# Altium schematic sheet F407.SchDoc
size A2
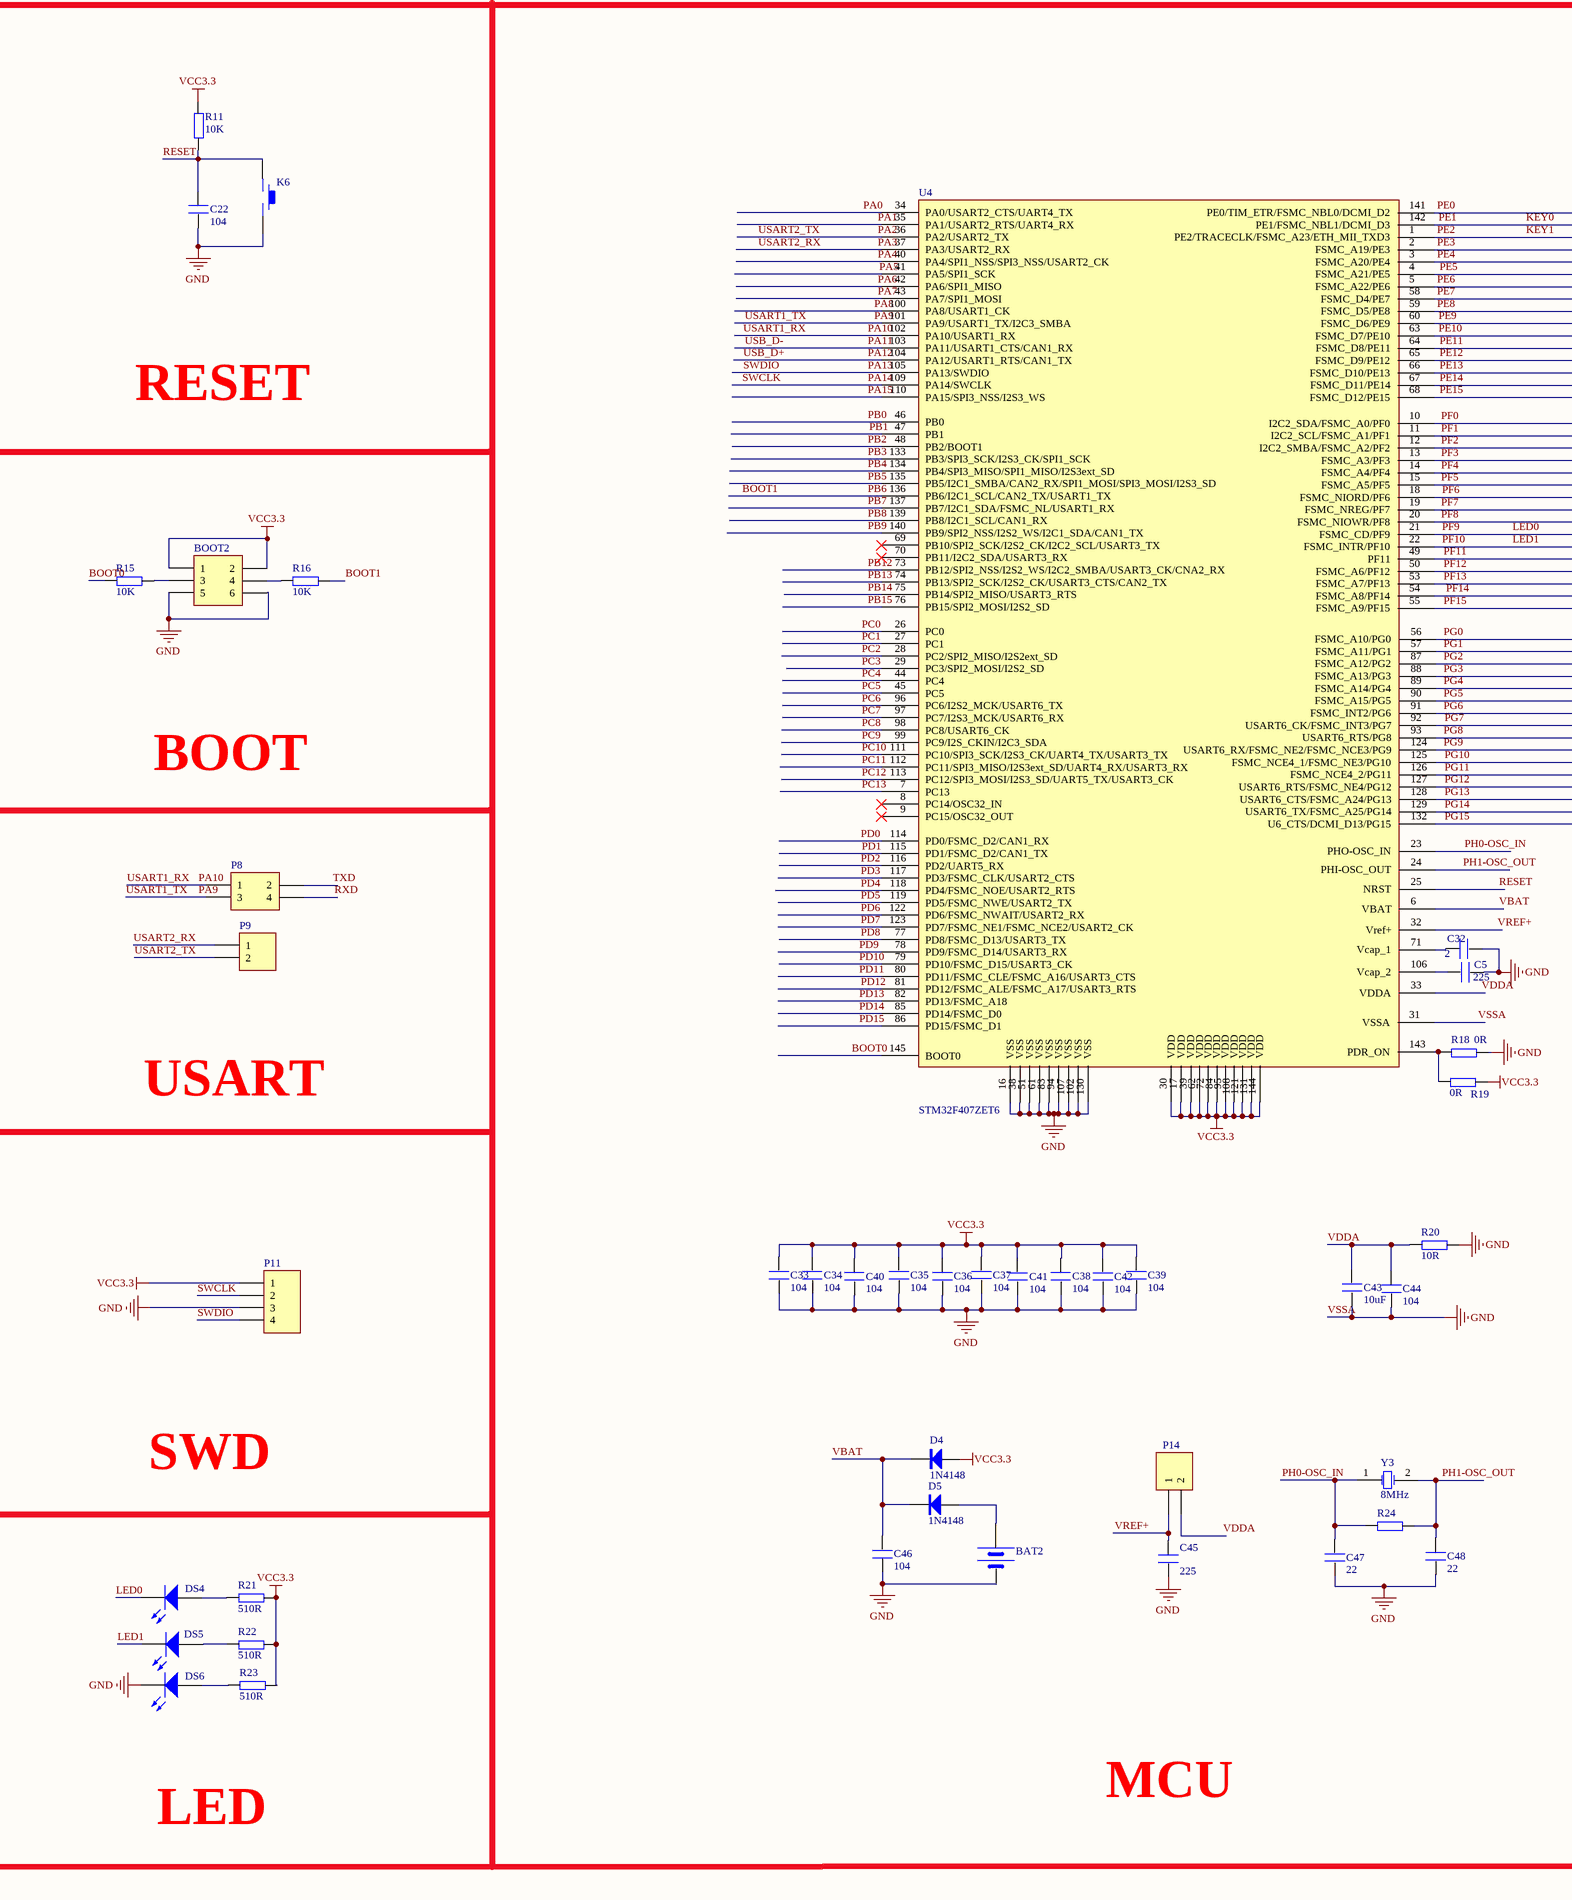
[diagram p0: F407.SchDoc, left]
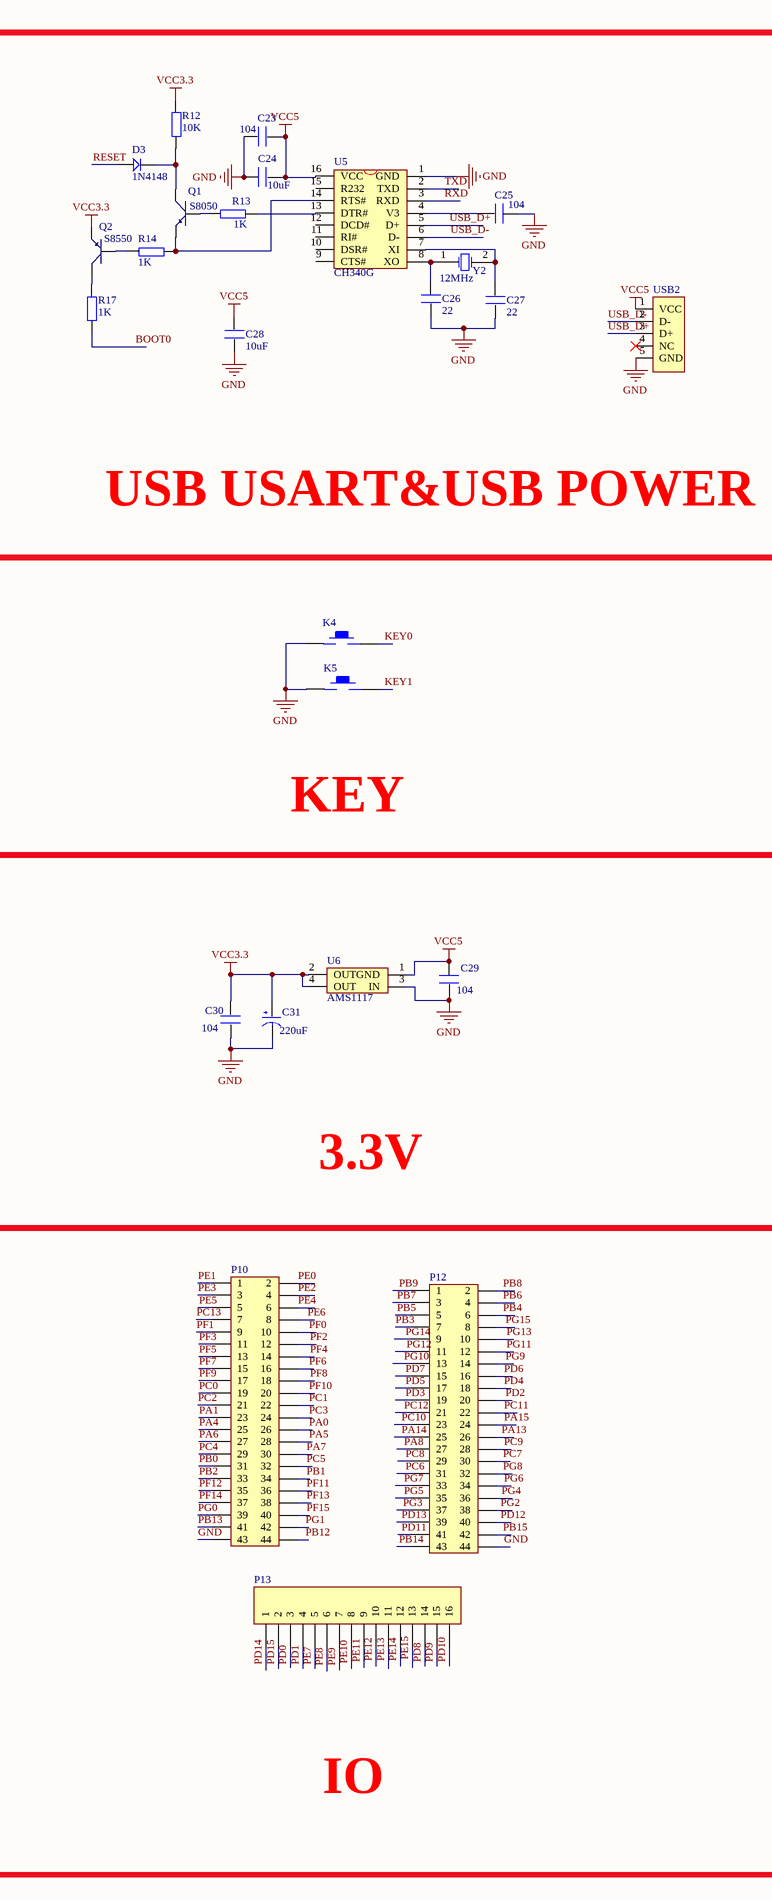
[diagram p1: F407.SchDoc, right]

## Parts
2  225  [0603P]
BAT2  BAT  [BATM]  (value not drawn)
BOOT2  Header 3X2  [HDR2X3]  (value not drawn)
C22  104  [0603P]
C23  104  [0603P]
C24  10uF  [0603P]
C25  104  [0603P]
C26  22  [0603P]
C27  22  [0603P]
C28  10uF  [0603P]
C29  104  [0603P]
C30  104  [0603P]
C31  220uF  [C1206]
C32  C5  [0603P]
C33  104  [0603P]
C34  104  [0603P]
C35  104  [0603P]
C36  104  [0603P]
C37  104  [0603P]
C38  104  [0603P]
C39  104  [0603P]
C40  104  [0603P]
C41  104  [0603P]
C42  104  [0603P]
C43  10uF  [0603P]
C44  104  [0603P]
C45  225  [0603P]
C46  104  [0603P]
C47  22  [0603P]
C48  22  [0603P]
D3  1N4148  [SOD-123]
D4  1N4148  [MINI_MELF (LL34)]
D5  1N4148  [MINI_MELF (LL34)]
DS4  LED0  [SMDLED]  (value not drawn)
DS5  LED1  [SMDLED]  (value not drawn)
DS6  LED3  [SMDLED]  (value not drawn)
K4  KEY_M  [KEY_M]  (value not drawn)
K5  KEY_M  [KEY_M]  (value not drawn)
K6  (no value)  [KEY_M]
P8  Header 2X2  [HDR2X2]  (value not drawn)
P9  Header 2  [HDR1X2]  (value not drawn)
P10  HEAD2*22  [HEAD2*22]  (value not drawn)
P11  Header 4  [HDR1X4]  (value not drawn)
P12  HEAD2*22  [HEAD2*22]  (value not drawn)
P13  Header 16  [HDR1X16]  (value not drawn)
P14  (no value)  [HDR1X2]
Q1  S8050  [SOT-23R]
Q2  S8550  [SOT-23R]
R11  10K  [0805]
R12  10K  [0805]
R13  1K  [0805]
R14  1K  [0805]
R15  10K  [0805]
R16  10K  [0805]
R17  1K  [0805]
R18  0R  [0805]
R19  0R  [0805]
R20  10R  [0805]
R21  510R  [0805]
R22  510R  [0805]
R23  510R  [0805]
R24  R  [0805]  (value not drawn)
U4  STM32F407ZET6  [LQFP144]
U5  CH340G  [SOP16M]
U6  AMS1117  [AMS1117]
USB2  USB5  [USB/SM0.8-6H5]  (value not drawn)
Y2  12MHz  [XTAL_US]
Y3  8MHz  [XTAL_US]

## Nets
GND: 2.2 BAT2.2(GND) BOOT2.5 BOOT2.6 C22.1 C23.1 C24.1 C25.1 C26.1 C27.1 C28.1 C29.1 C30.1 C31.2(GND) C32.2 C33.1 C34.1 C35.1 C36.1 C37.1 C38.1 C39.1 C40.1 C41.1 C42.1 C43.1 C44.1 C45.1 C46.2 C47.1 C48.1 DS6.2(K) K4.1 K5.1 K6.2 P10.43 P11.3 P12.44 R18.2 R20.2 U4.16(VSS) U4.31(VSSA) U4.38(VSS) U4.51(VSS) U4.61(VSS) U4.83(VSS) U4.94(VSS) U4.102(VSS) U4.107(VSS) U4.130(VSS) U5.1(GND) U6.3(IN) USB2.5(GND)  [also labelled VSSA]
VCC3.3: BOOT2.1 BOOT2.2 C30.2 C31.1(VCC) C33.2 C34.2 C35.2 C36.2 C37.2 C38.2 C39.2 C40.2 C41.2 C42.2 D4.1(A) P11.1 Q2.1(E) R11.2 R12.2 R19.2 R21.2 R22.2 R23.2 U4.17(VDD) U4.30(VDD) U4.39(VDD) U4.62(VDD) U4.72(VDD) U4.84(VDD) U4.95(VDD) U4.108(VDD) U4.121(VDD) U4.131(VDD) U4.144(VDD) U6.2(OUT) U6.4(OUT)
VCC5: C23.2 C24.2 C28.2 C29.2 U5.16(VCC) U6.1(GND) USB2.1(VCC)
BOOT0: R15.1 R17.1 U4.145(BOOT0)
BOOT1: P12.4 R16.2 U4.136(PB6/I2C1_SCL/CAN2_TX/USART1_TX)  [also labelled PB6]
KEY0: K4.2 P10.1 U4.142(PE1/FSMC_NBL1/DCMI_D3)  [also labelled PE1]
KEY1: K5.2 P10.4 U4.1(PE2/TRACECLK/FSMC_A23/ETH_MII_TXD3)  [also labelled PE2]
LED0: DS4.2(K) P10.17 U4.21(FSMC_CD/PF9)  [also labelled PF9]
LED1: DS5.2(K) P10.20 U4.22(FSMC_INTR/PF10)  [also labelled PF10]
PA0: P10.26 U4.34(PA0/USART2_CTS/UART4_TX)
PA1: P10.23 U4.35(PA1/USART2_RTS/UART4_RX)
PA2: P9.2 U4.36(PA2/USART2_TX)  [also labelled USART2_TX]
PA3: P9.1 U4.37(PA3/USART2_RX)  [also labelled USART2_RX]
PA4: P10.25 U4.40(PA4/SPI1_NSS/SPI3_NSS/USART2_CK)
PA5: P10.28 U4.41(PA5/SPI1_SCK)
PA6: P10.27 U4.42(PA6/SPI1_MISO)
PA7: P10.30 U4.43(PA7/SPI1_MOSI)
PA8: P12.27 U4.100(PA8/USART1_CK)
PA9: P8.3 U4.101(PA9/USART1_TX/I2C3_SMBA)  [also labelled USART1_TX]
PA10: P8.1 U4.102(PA10/USART1_RX)  [also labelled USART1_RX]
PA11: U4.103(PA11/USART1_CTS/CAN1_RX) U5.6(D-) USB2.2(D-)  [also labelled USB_D-]
PA12: U4.104(PA12/USART1_RTS/CAN1_TX) U5.5(D+) USB2.3(D+)  [also labelled USB_D+]
PA13: P11.4 P12.26 U4.105(PA13/SWDIO)  [also labelled SWDIO]
PA14: P11.2 P12.25 U4.109(PA14/SWCLK)  [also labelled SWCLK]
PA15: P12.24 U4.110(PA15/SPI3_NSS/I2S3_WS)
PB0: P10.31 U4.46(PB0)
PB1: P10.34 U4.47(PB1)
PB2: P10.33 U4.48(PB2/BOOT1)
PB3: P12.7 U4.133(PB3/SPI3_SCK/I2S3_CK/SPI1_SCK)
PB4: P12.6 U4.134(PB4/SPI3_MISO/SPI1_MISO/I2S3ext_SD)
PB5: P12.5 U4.135(PB5/I2C1_SMBA/CAN2_RX/SPI1_MOSI/SPI3_MOSI/I2S3_SD)
PB7: P12.3 U4.137(PB7/I2C1_SDA/FSMC_NL/USART1_RX)
PB8: P12.2 U4.139(PB8/I2C1_SCL/CAN1_RX)
PB9: P12.1 U4.140(PB9/SPI2_NSS/I2S2_WS/I2C1_SDA/CAN1_TX)
PB12: P10.44 U4.73(PB12/SPI2_NSS/I2S2_WS/I2C2_SMBA/USART3_CK/CNA2_RX)
PB13: P10.41 U4.74(PB13/SPI2_SCK/I2S2_CK/USART3_CTS/CAN2_TX)
PB14: P12.43 U4.75(PB14/SPI2_MISO/USART3_RTS)
PB15: P12.42 U4.76(PB15/SPI2_MOSI/I2S2_SD)
PC0: P10.19 U4.26(PC0)
PC1: P10.22 U4.27(PC1)
PC2: P10.21 U4.28(PC2/SPI2_MISO/I2S2ext_SD)
PC3: P10.24 U4.29(PC3/SPI2_MOSI/I2S2_SD)
PC4: P10.29 U4.44(PC4)
PC5: P10.32 U4.45(PC5)
PC6: P12.31 U4.96(PC6/I2S2_MCK/USART6_TX)
PC7: P12.30 U4.97(PC7/I2S3_MCK/USART6_RX)
PC8: P12.29 U4.98(PC8/USART6_CK)
PC9: P12.28 U4.99(PC9/I2S_CKIN/I2C3_SDA)
PC10: P12.23 U4.111(PC10/SPI3_SCK/I2S3_CK/UART4_TX/USART3_TX)
PC11: P12.22 U4.112(PC11/SPI3_MISO/I2S3ext_SD/UART4_RX/USART3_RX)
PC12: P12.21 U4.113(PC12/SPI3_MOSI/I2S3_SD/UART5_TX/USART3_CK)
PC13: P10.7 U4.7(PC13)
PD0: P13.3 U4.114(PD0/FSMC_D2/CAN1_RX)
PD1: P13.4 U4.115(PD1/FSMC_D2/CAN1_TX)
PD2: P12.20 U4.116(PD2/UART5_RX)
PD3: P12.19 U4.117(PD3/FSMC_CLK/USART2_CTS)
PD4: P12.18 U4.118(PD4/FSMC_NOE/USART2_RTS)
PD5: P12.17 U4.119(PD5/FSMC_NWE/USART2_TX)
PD6: P12.16 U4.122(PD6/FSMC_NWAIT/USART2_RX)
PD7: P12.15 U4.123(PD7/FSMC_NE1/FSMC_NCE2/USART2_CK)
PD8: P13.14 U4.77(PD8/FSMC_D13/USART3_TX)
PD9: P13.15 U4.78(PD9/FSMC_D14/USART3_RX)
PD10: P13.16 U4.79(PD10/FSMC_D15/USART3_CK)
PD11: P12.41 U4.80(PD11/FSMC_CLE/FSMC_A16/USART3_CTS)
PD12: P12.40 U4.81(PD12/FSMC_ALE/FSMC_A17/USART3_RTS)
PD13: P12.39 U4.82(PD13/FSMC_A18)
PD14: P13.1 U4.85(PD14/FSMC_D0)
PD15: P13.2 U4.86(PD15/FSMC_D1)
PE0: P10.2 U4.141(PE0/TIM_ETR/FSMC_NBL0/DCMI_D2)
PE3: P10.3 U4.2(FSMC_A19/PE3)
PE4: P10.6 U4.3(FSMC_A20/PE4)
PE5: P10.5 U4.4(FSMC_A21/PE5)
PE6: P10.8 U4.5(FSMC_A22/PE6)
PE7: P13.5 U4.58(FSMC_D4/PE7)
PE8: P13.6 U4.59(FSMC_D5/PE8)
PE9: P13.7 U4.60(FSMC_D6/PE9)
PE10: P13.8 U4.63(FSMC_D7/PE10)
PE11: P13.9 U4.64(FSMC_D8/PE11)
PE12: P13.10 U4.65(FSMC_D9/PE12)
PE13: P13.11 U4.66(FSMC_D10/PE13)
PE14: P13.12 U4.67(FSMC_D11/PE14)
PE15: P13.13 U4.68(FSMC_D12/PE15)
PF0: P10.10 U4.10(I2C2_SDA/FSMC_A0/PF0)
PF1: P10.9 U4.11(I2C2_SCL/FSMC_A1/PF1)
PF2: P10.12 U4.12(I2C2_SMBA/FSMC_A2/PF2)
PF3: P10.11 U4.13(FSMC_A3/PF3)
PF4: P10.14 U4.14(FSMC_A4/PF4)
PF5: P10.13 U4.15(FSMC_A5/PF5)
PF6: P10.16 U4.18(FSMC_NIORD/PF6)
PF7: P10.15 U4.19(FSMC_NREG/PF7)
PF8: P10.18 U4.20(FSMC_NIOWR/PF8)
PF11: P10.36 U4.49(PF11)
PF12: P10.35 U4.50(FSMC_A6/PF12)
PF13: P10.38 U4.53(FSMC_A7/PF13)
PF14: P10.37 U4.54(FSMC_A8/PF14)
PF15: P10.40 U4.55(FSMC_A9/PF15)
PG0: P10.39 U4.56(FSMC_A10/PG0)
PG1: P10.42 U4.57(FSMC_A11/PG1)
PG2: P12.38 U4.87(FSMC_A12/PG2)
PG3: P12.37 U4.88(FSMC_A13/PG3)
PG4: P12.36 U4.89(FSMC_A14/PG4)
PG5: P12.35 U4.90(FSMC_A15/PG5)
PG6: P12.34 U4.91(FSMC_INT2/PG6)
PG7: P12.33 U4.92(USART6_CK/FSMC_INT3/PG7)
PG8: P12.32 U4.93(USART6_RTS/PG8)
PG9: P12.14 U4.124(USART6_RX/FSMC_NE2/FSMC_NCE3/PG9)
PG10: P12.13 U4.125(FSMC_NCE4_1/FSMC_NE3/PG10)
PG11: P12.12 U4.126(FSMC_NCE4_2/PG11)
PG12: P12.11 U4.127(USART6_RTS/FSMC_NE4/PG12)
PG13: P12.10 U4.128(USART6_CTS/FSMC_A24/PG13)
PG14: P12.9 U4.129(USART6_TX/FSMC_A25/PG14)
PG15: P12.8 U4.132(U6_CTS/DCMI_D13/PG15)
PH0-OSC_IN: C47.2 R24.1 U4.23(PHO-OSC_IN) Y3.1(OSC1)
PH1-OSC_OUT: C48.2 R24.2 U4.24(PHI-OSC_OUT) Y3.2(OSC2)
RESET: C22.2 D3.1 K6.1 R11.1 U4.25(NRST)
RXD: P8.4 U5.3(RXD)
TXD: P8.2 U5.2(TXD)
VBAT: C46.1 D4.2(K) D5.2(K) U4.6(VBAT)
VDDA: C43.2 C44.2 P14.2 R20.1 U4.33(VDDA)
VREF+: C45.2 P14.1 U4.32(Vref+)
Net2_1: 2.1 U4.106(Vcap_2)
NetBAT2_1: BAT2.1(VCC) D5.1(A)
NetBOOT2_3: BOOT2.3 R15.2
NetBOOT2_4: BOOT2.4 R16.1
NetC25_2: C25.2 U5.4(V3)
NetC26_2: C26.2 U5.8(XO) Y2.1(OSC1)
NetC27_2: C27.2 U5.7(XI) Y2.2(OSC2)
NetC32_1: C32.1 U4.71(Vcap_1)
NetD3_2: D3.2 Q1.3(C) R12.1
NetDS4_1: DS4.1(A) R21.1
NetDS5_1: DS5.1(A) R22.1
NetDS6_1: DS6.1(A) R23.1
NetQ1_1: Q1.1(E) R14.2 U5.14(RTS#)
NetQ1_2: Q1.2(B) R13.1
NetQ2_2: Q2.2(B) R14.1
NetQ2_3: Q2.3(C) R17.2
NetR13_2: R13.2 U5.13(DTR#)
NetR18_1: R18.1 R19.1 U4.143(PDR_ON)

Not connected (* = marked no-connect by the designer): U4 8(PC14/OSC32_IN)* 9(PC15/OSC32_OUT)* 69(PB10/SPI2_SCK/I2S2_CK/I2C2_SCL/USART3_TX)* 70(PB11/I2C2_SDA/USART3_RX)*; U5 9(CTS#) 10(DSR#) 11(RI#) 12(DCD#) 15(R232); USB2 4(NC)*

## Notes on the sheet
- RESET
- USB USART&USB POWER
- BOOT
- KEY
- USART
- 3.3V
- SWD
- MCU
- IO
- LED

## Library data of the parts
2 C22-C30 C32-C48 = C
BOOT2 = Header 3X2: Header, 3-Pin, Dual row; LatestRevisionDate: *; LatestRevisionNote: *; Publisher: *
C31 = CAP
D3 = D
D4 D5 = 1N4148: 高速开关二极管; 版权归属: 源创客; BOM名称: 高速开关二极管; 学习资源: www.ooocke.com
DS4-DS6 = LED2: Typical RED, GREEN, YELLOW, AMBER GaAs LED; Published: *; LatestRevisionDate: *; LatestRevisionNote: *; PackageDocument: *; PackageReference: *; Publisher: *
K6 = KEY_M
P8 = Header 2X2: Header, 2-Pin, Dual row; LatestRevisionDate: *; LatestRevisionNote: *; Publisher: *
P9 P14 = Header 2: Header, 2-Pin; LatestRevisionDate: *; LatestRevisionNote: *; Publisher: *
P11 = Header 4: Header, 4-Pin; LatestRevisionDate: *; LatestRevisionNote: *; Publisher: *
P13 = Header 16: Header, 16-Pin; LatestRevisionDate: *; LatestRevisionNote: *; Publisher: *
Q1 = NPN: 8050/BCW846/BCW847
Q2 = PNP: 8550/BCW68
R11-R23 = R
U5 = CH340G: USB2UART
Y2 Y3 = XTAL: Crystal Oscillator; Published: *; LatestRevisionDate: *; LatestRevisionNote: *; Publisher: *